# EAGLE design USB_ow (EAGLE 7.5.0)
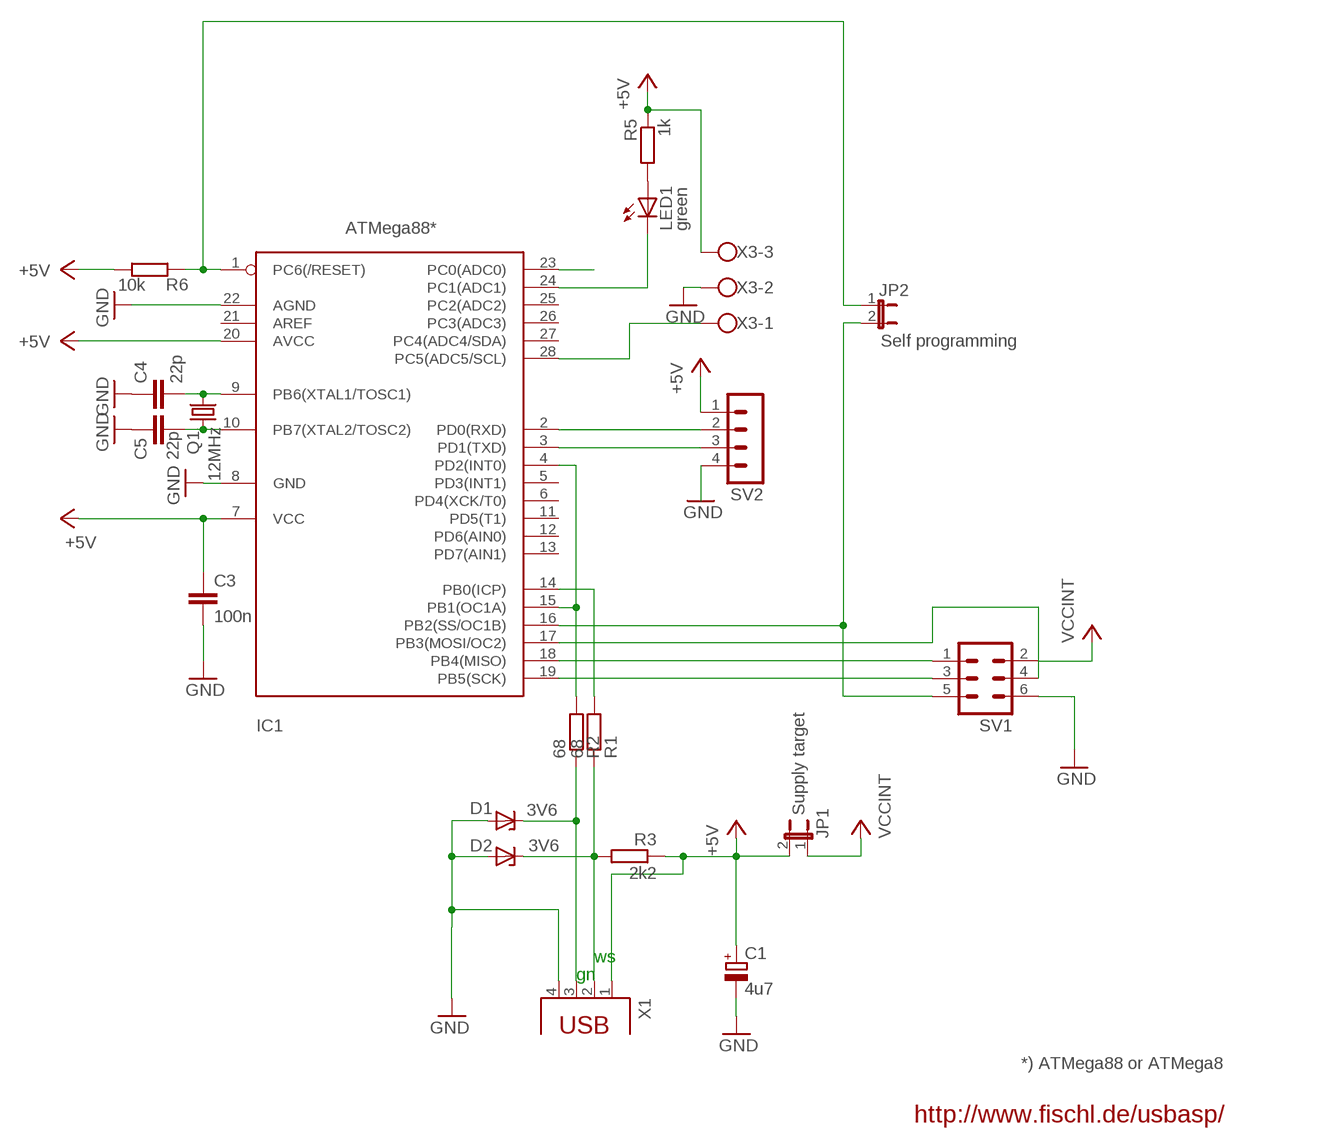
[diagram p0: schematic, sheet 1]

## Parts
C1  4u7  CPOL-EUE2.5-5  [E2,5-5]
C3  100n  C-EU025-024X044  [C025-024X044]
C4  22p  C-EU025-024X044  [C025-024X044]
C5  22p  C-EU025-024X044  [C025-024X044]
D1  3V6  ZENER-DIODEDO34-7  [DO34Z7]
D2  3V6  ZENER-DIODEDO34-7  [DO34Z7]
IC1  ATMega88*  MEGA8-P  [DIL28-3]
JP1  Supply target  JP1E  [JP1]
JP2  Self programming  JP1E  [JP1]
LED1  green  LED3MM  [LED3MM]
Q1  12MHz  CRYTALHC49S  [HC49/S]
R1  68  R-EU_0207/10  [0207/10]
R2  68  R-EU_0207/10  [0207/10]
R3  2k2  R-EU_0207/10  [0207/10]
R5  1k  R-EU_0207/10  [0207/10]
R6  10k  R-EU_0207/10  [0207/10]
SV1  MA03-2  [MA03-2]
SV2  MA04-1  [MA04-1]
X1  PN61729  [PN61729]
X3  W237-103  [W237-103]

## Nets
+5V: C1.+ C3.1 IC1.7(VCC) IC1.20(AVCC) JP1.2 R3.1 R5.1 R6.1 SV2.1 X1.1 X3.3
D+: D1.C R2.1 X1.3
D-: D2.C R1.1 R3.2 X1.2
GND: C1.- C3.2 C4.1 C5.1 D1.A D2.A IC1.8(GND) IC1.22(AGND) SV1.6 SV2.4 X1.4 X3.2
N$2: IC1.16(PB2(SS/OC1B)) JP2.2 SV1.5
N$3: IC1.17(PB3(MOSI/OC2)) SV1.4
N$4: IC1.19(PB5(SCK)) SV1.3
N$6: IC1.18(PB4(MISO)) SV1.1
N$7: IC1.4(PD2(INT0)) IC1.15(PB1(OC1A)) R2.2
N$9: IC1.28(PC5(ADC5/SCL)) X3.1
N$14: IC1.23(PC0(ADC0))
N$15: IC1.24(PC1(ADC1)) LED1.K(C)
N$16: IC1.14(PB0(ICP)) R1.2
N$22: C4.2 IC1.9(PB6(XTAL1/TOSC1)) Q1.2
N$23: C5.2 IC1.10(PB7(XTAL2/TOSC2)) Q1.1
N$25: LED1.A R5.2
RESET: IC1.1(PC6(/RESET)) JP2.1 R6.2
RXD: IC1.2(PD0(RXD)) SV2.2
TXD: IC1.3(PD1(TXD)) SV2.3
VCCINT: JP1.1 SV1.2
Unconnected: IC1.5(PD3(INT1)) IC1.6(PD4(XCK/T0)) IC1.11(PD5(T1)) IC1.12(PD6(AIN0)) IC1.13(PD7(AIN1)) IC1.21(AREF) IC1.25(PC2(ADC2)) IC1.26(PC3(ADC3)) IC1.27(PC4(ADC4/SDA))

## Notes on the sheet
- ws
- gn
- *) ATMega88 or ATMega8
- http://www.fischl.de/usbasp/

## Library data of the parts
C1 = rcl:CPOL-EU: POLARIZED CAPACITOR, European symbol
C3-C5 = rcl:C-EU: CAPACITOR, European symbol
D1 D2 = diode:ZENER-DIODE: Z-Diode
IC1 = atmel:MEGA8-P: MICROCONTROLLER 8 Kbytes FLASH 1 kbytes SRAM 512 bytes EEPROM USART 4-channel 10 bit ADC 2-channel 8 bit ADC Source: avr.lbr
JP1 JP2 = jumper:JP1E: JUMPER
LED1 = led:LED: LED OSRAM: - CHIPLED LG R971, LG N971, LY N971, LG Q971, LY Q971, LO R971, LY R971 LH N974, LH R974 LS Q976, LO Q976, LY Q976 LO Q996 - Hyper CHIPLED LW Q18S LB Q993, LB Q99A, LB R99A - SideLED LS A670, LO A670, LY A670, LG A670, LP A670 LB A673, LV A673, LT A673, LW A673 LH A674 LY A675 LS A676, LA A676, LO A676, LY A676, LW A676 LS A679, LY A679, LG A679 - Hyper Micro SIDELED® LS Y876, LA Y876, LO Y876, LY Y876 LT Y87S - SmartLED LW L88C, LW L88S LB L89C, LB L89S, LG L890 LS L89K, LO L89K, LY L89K LS L896, LA L896, LO L896, LY L896 - TOPLED LS T670, LO T670, LY T670, LG T670, LP T670 LSG T670, LSP T670, LSY T670, LOP T670, LYG T670 LG T671, LOG T671, LSG T671 LB T673, LV T673, LT T673, LW T673 LH T674 LS T676, LA T676, LO T676, LY T676, LB T676, LH T676, LSB T676, LW T676 LB T67C, LV T67C, LT T67C, LS T67K, LO T67K, LY T67K, LW E67C LS E67B, LA E67B, LO E67B, LY E67B, LB E67C, LV E67C, LT E67C LW T67C LS T679, LY T679, LG T679 LS T770, LO T770, LY T770, LG T770, LP T770 LB T773, LV T773, LT T773, LW T773 LH T774 LS E675, LA E675, LY E675, LS T675 LS T776, LA T776, LO T776, LY T776, LB T776 LHGB T686 LT T68C, LB T68C - Hyper Mini TOPLED® LB M676 - Mini TOPLED Santana® LG M470 LS M47K, LO M47K, LY M47K Source: http://www.osram.convergy.de/
Q1 = crystal:CRYTAL: CRYSTAL
R1-R3 R5 R6 = rcl:R-EU_: RESISTOR, European symbol
SV1 = con-lstb:MA03-2: PIN HEADER; OC_FARNELL: unknown; OC_NEWARK: unknown
SV2 = con-lstb:MA04-1: PIN HEADER; OC_FARNELL: unknown; OC_NEWARK: unknown
X1 = con-berg:PN61729: BERG USB connector
X3 = con-wago-500:W237-103: WAGO SCREW CLAMP; MPN: 237-103; OC_FARNELL: unknown; OC_NEWARK: 18M7116

## Board
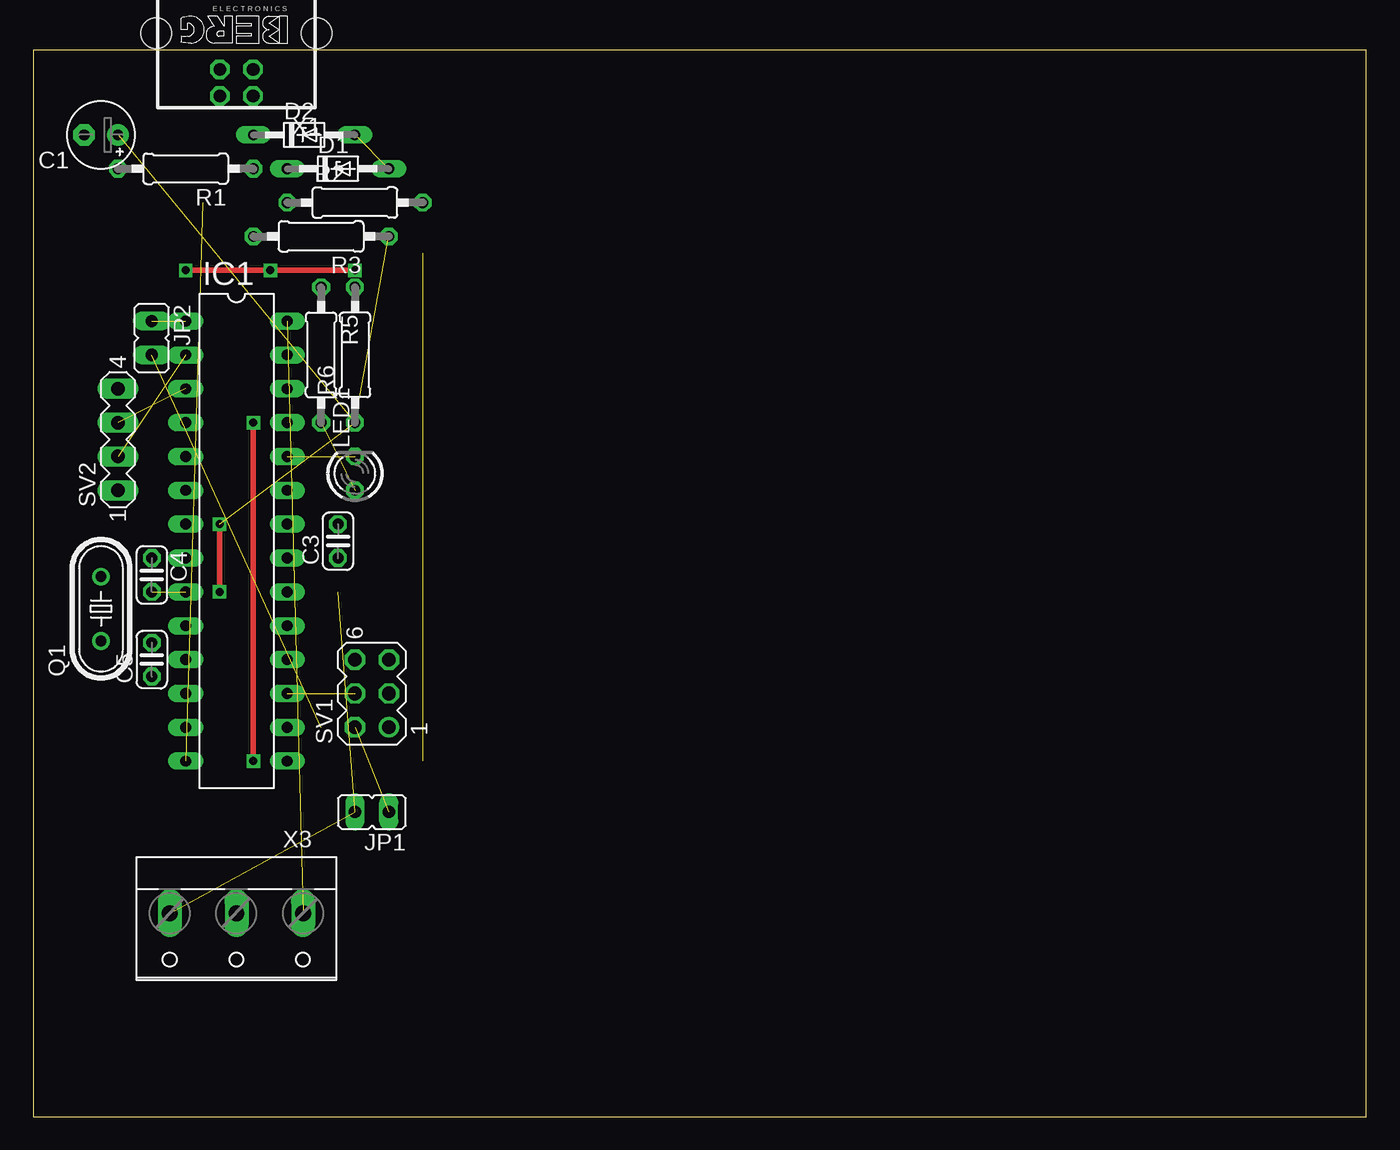
[diagram p1: board, top side]
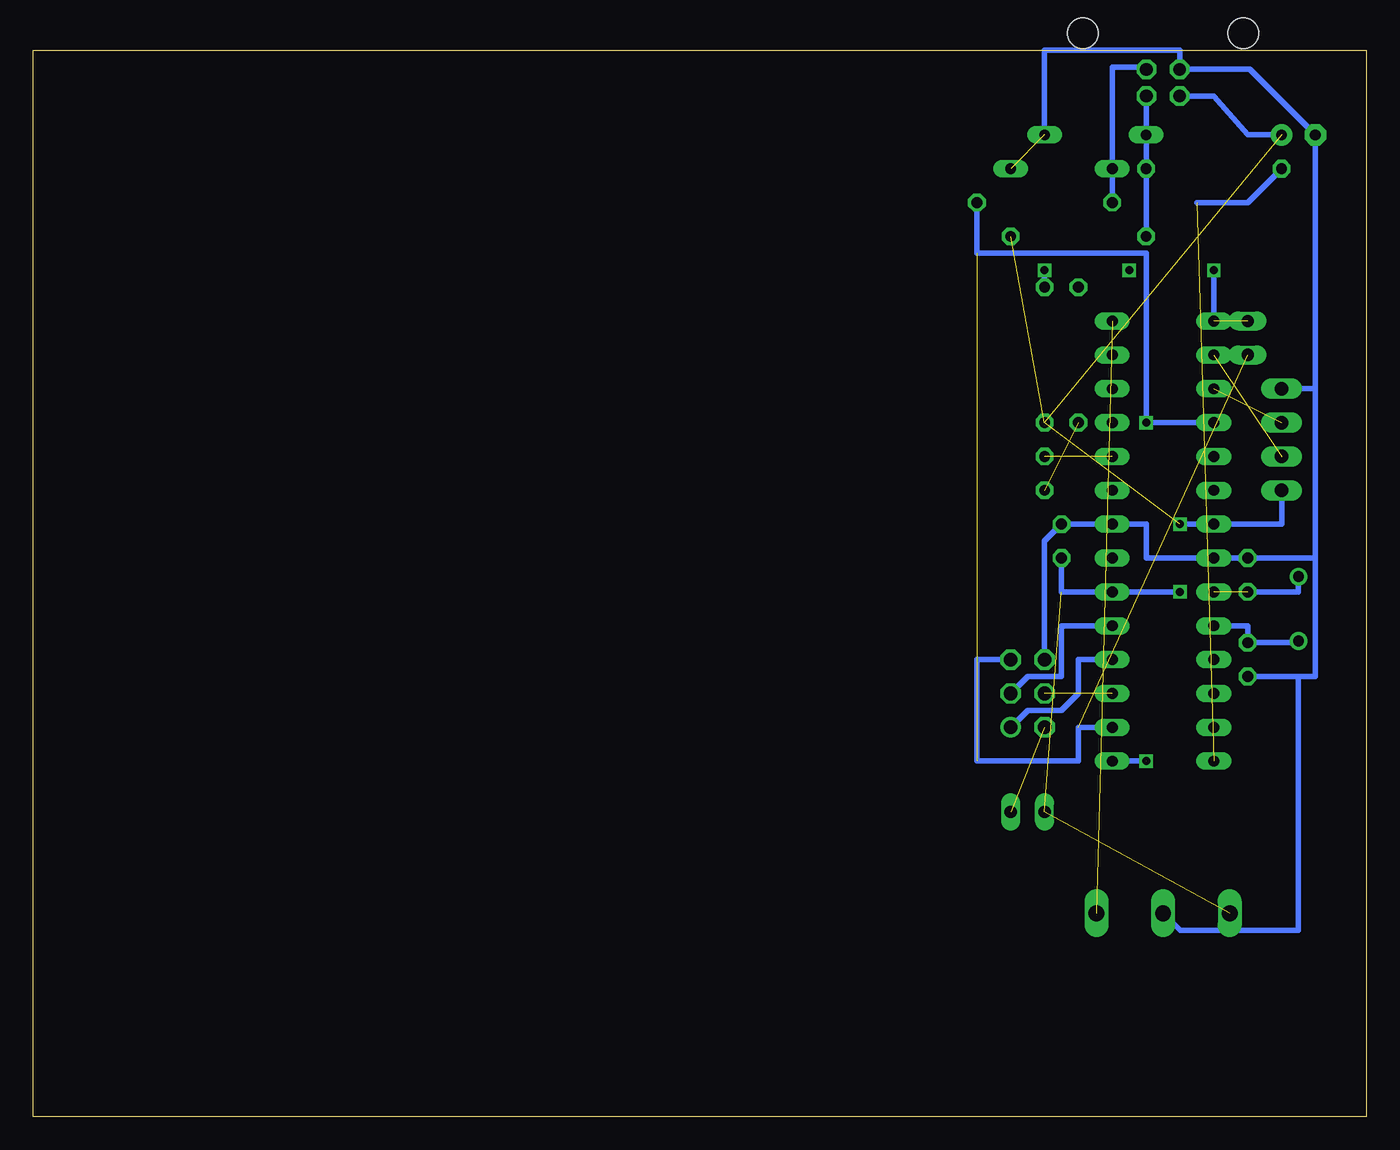
[diagram p2: board, bottom side, seen from below]

Size 100 x 80 mm. Coordinates in mm from the lower left corner, seen from the top.
Outline: 0,0 100,0 100,80 0,80 0,0
Copper layers (1*16): Top 0.035mm / dielectric 1.5mm / Bottom 0.035mm
Design rules "default": minimum track width 10mil, minimum drill 24mil, track to track 8mil, track to pad 8mil, pad to pad 8mil, via to via 8mil, smd to smd 8mil, copper to edge 40mil, drill to drill 8mil, minimum pad ring 10mil, minimum via ring 8mil, stop-mask expansion 4mil, vias tented up to drill 0mil, thermal gap 10mil

### Footprints (pad centres in the part's own frame; a part is rotated, then mirrored left to right if it is on the bottom)
E2,5-5 = drill 0.813 pad 1.6: + -1.27,0 | drill 0.813 pad 1.6 octagon: - 1.27,0
C025-024X044 = drill 0.813 octagon: 1 -1.27,0; 2 1.27,0
DO34Z7 = drill 0.813 long: A 3.81,0; C -3.81,0
DIL28-3 = drill 0.813 long: 1 -16.51,-3.81; 2 -13.97,-3.81; 3 -11.43,-3.81; 4 -8.89,-3.81; 5 -6.35,-3.81; 6 -3.81,-3.81; 7 -1.27,-3.81; 8 1.27,-3.81; 9 3.81,-3.81; 10 6.35,-3.81; 11 8.89,-3.81; 12 11.43,-3.81; 13 13.97,-3.81; 14 16.51,-3.81; 15 16.51,3.81; 16 13.97,3.81; 17 11.43,3.81; 18 8.89,3.81; 19 6.35,3.81; 20 3.81,3.81; 21 1.27,3.81; 22 -1.27,3.81; 23 -3.81,3.81; 24 -6.35,3.81; 25 -8.89,3.81; 26 -11.43,3.81; 27 -13.97,3.81; 28 -16.51,3.81
JP1 = drill 0.914 long: 1 0,-1.27; 2 0,1.27
LED3MM = drill 0.813 octagon: A -1.27,0; K 1.27,0
HC49/S = drill 0.813: 1 -2.413,0; 2 2.413,0
0207/10 = drill 0.813 octagon: 1 -5.08,0; 2 5.08,0
MA03-2 = drill 1.016: 1 -2.54,-1.27 | drill 1.016 octagon: 2 -2.54,1.27; 3 0,-1.27; 4 0,1.27; 5 2.54,-1.27; 6 2.54,1.27
MA04-1 = drill 1.016 long: 1 -3.81,0; 2 -1.27,0; 3 1.27,0; 4 3.81,0
PN61729 = drill 0.95 octagon: 1 1.25,4.71; 2 -1.25,4.71; 3 -1.25,2.71; 4 1.25,2.71 | hole 2.3: -6.02,0; 6.02,0
W237-103 = drill 1.194 long: 1 -5,-1.29; 2 0,-1.29; 3 5,-1.29

### Placement (x,y rotation side)
C1  5.08,73.66 180 top
C3  22.86,43.18 90 top
C4  8.89,40.64 270 top
C5  8.89,34.29 90 top
D1  22.86,71.12 0 top
D2  20.32,73.66 0 top
IC1  15.24,43.18 270 top
JP1  25.4,22.86 90 top
JP2  8.89,58.42 180 top
LED1  24.13,48.26 90 top
Q1  5.08,38.1 90 top
R1  11.43,71.12 180 top
R2  24.13,68.58 0 top
R3  21.59,66.04 180 top
R5  21.59,57.15 270 top
R6  24.13,57.15 90 top
SV1  25.4,31.75 90 top
SV2  6.35,50.8 90 top
X1  15.24,81.28 180 top
X3  15.24,13.97 180 top

### Tracks (layer width: path | path; a pad name or v marks a point on that pad's centre or on a via)
+5V  (via drill 0.6)  (5 unrouted)
  Top 0.406: v13.97,39.37 v13.97,44.45
  Bottom 0.406: C3.1 22.86,39.37 IC1.20 v13.97,39.37 | v13.97,44.45 IC1.7 6.35,44.45 SV2.1 | X1.1 11.43,76.55 8.89,73.66 C1.+
D+
  Bottom 0.406: X1.3 16.66,78.74 19.05,78.74 D1.C R2.1
D-
  Bottom 0.406: X1.2 16.51,76.55 D2.C R1.1 R3.2
GND  (1 unrouted)
  Bottom 0.406: C5.1 5.08,33.02 | 5.08,33.02 3.81,33.02 3.81,41.91 | 3.81,41.91 C4.1 IC1.8 16.51,41.91 16.51,44.45 IC1.22 C3.2 24.13,43.18 SV1.6 | X3.2 13.95,13.97 5.08,13.97 5.08,33.02 | D2.A 24.13,80.01 13.97,80.01 13.97,78.59 X1.4 8.72,78.57 C1.- 3.81,54.61 | SV2.4 3.81,54.61 | 3.81,41.91 3.81,54.61
N$1  (via drill 0.6)
  other vias: 17.78,63.5
N$2  (1 unrouted)
  Bottom 0.406: IC1.16 21.59,29.21 21.59,26.67 29.21,26.67 29.21,34.29 SV1.5
N$3  (1 unrouted)
N$4
  Bottom 0.406: IC1.19 22.86,36.83 22.86,33.02 25.4,33.02 SV1.3
N$5  (via drill 0.6)
  other vias: 11.43,63.5
N$6
  Bottom 0.406: SV1.1 25.4,30.48 22.86,30.48 21.59,31.75 21.59,34.29 IC1.18
N$7  (via drill 0.6)  (2 unrouted)
  Top 0.406: v16.51,52.07 16.51,26.67
  Bottom 0.406: IC1.4 v16.51,52.07 16.51,64.77 29.21,64.77 R2.2 | IC1.15 16.51,26.67
N$9  (1 unrouted)
N$10  (via drill 0.6)
  other vias: 16.51,52.07
N$11  (via drill 0.6)
  other vias: 16.51,26.67
N$15  (1 unrouted)
N$16  (1 unrouted)
  Bottom 0.406: R1.2 8.89,68.58 12.7,68.58
N$22  (1 unrouted)
  Bottom 0.406: Q1.2 5.08,39.37 C4.2
N$23
  Bottom 0.406: Q1.1 5.08,35.56 C5.2 8.89,36.83 IC1.10
N$25  (1 unrouted)
RESET  (via drill 0.6)  (1 unrouted)
  Top 0.406: 11.43,63.5 v24.13,63.5
  Bottom 0.406: R6.2 v24.13,63.5 | IC1.1 11.43,63.5
RXD  (1 unrouted)
TXD  (1 unrouted)
VCCINT  (1 unrouted)